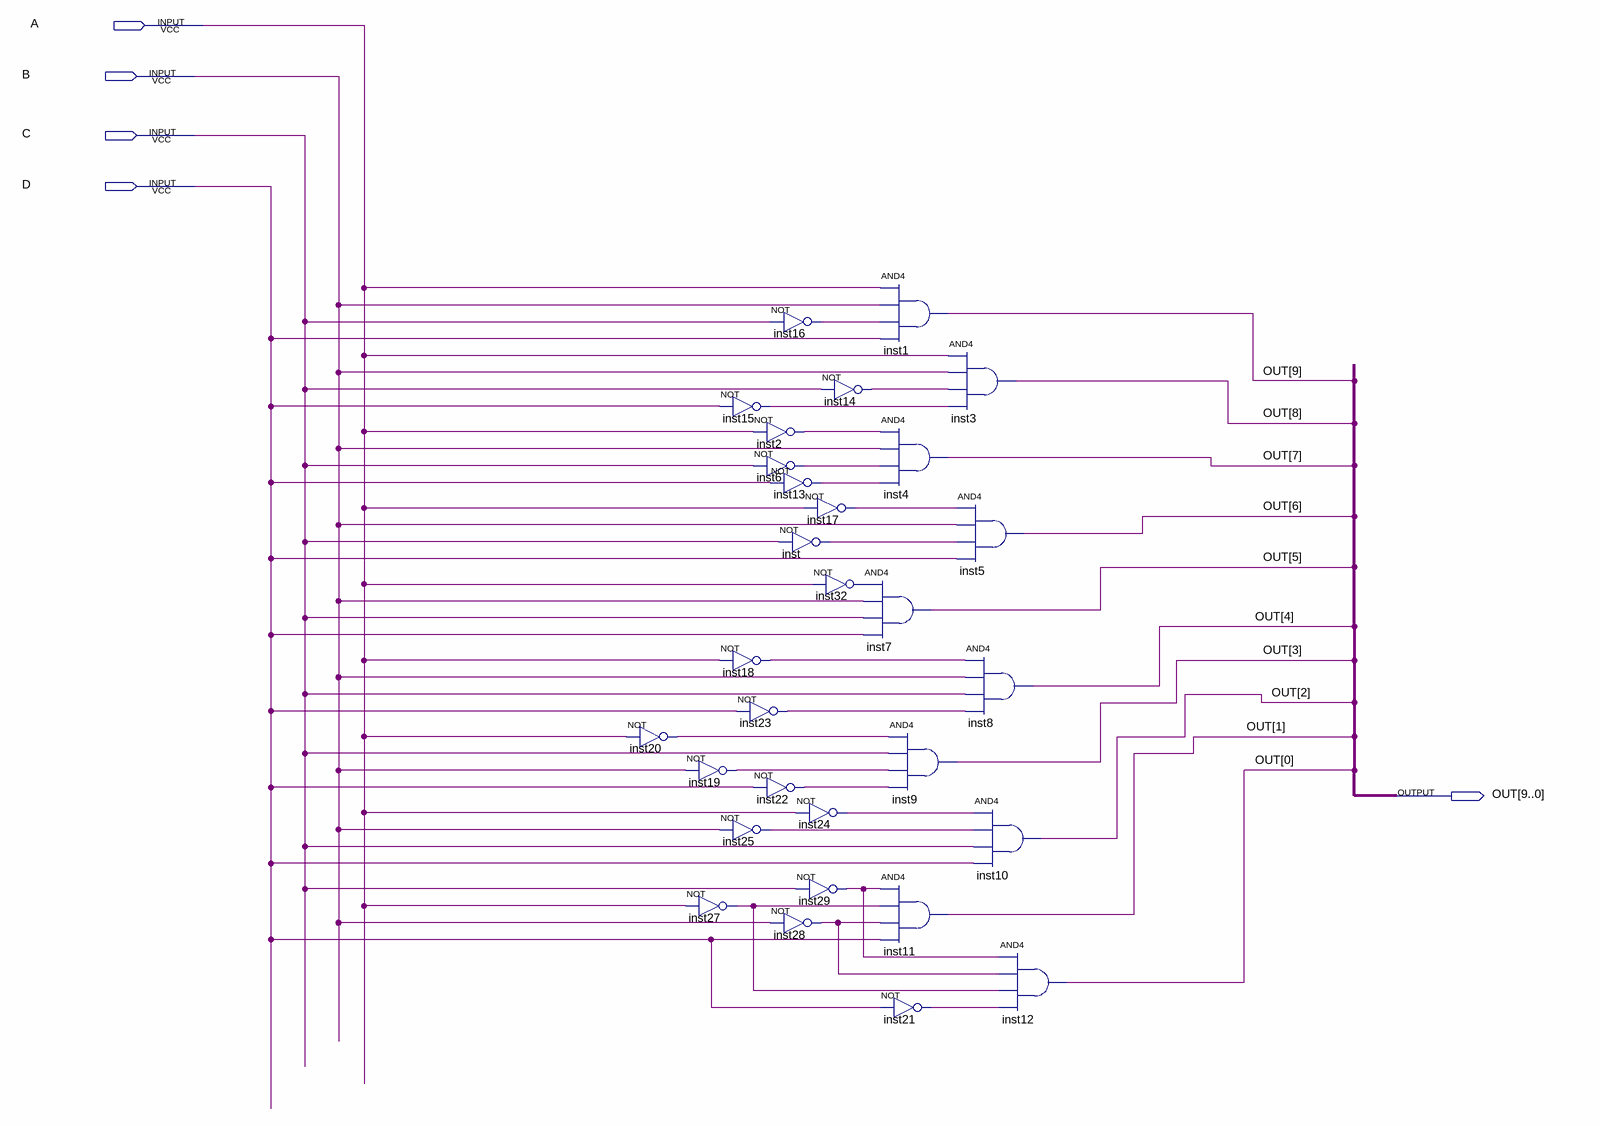
[diagram p0: schematic sheet]
// Quartus schematic Block5.bdf as structural Verilog: 30 symbols, 5 pins
module Block5 (
  input  A,
  input  B,
  input  C,
  input  D,
  output [9:0] OUT
);

  wire inst2_out, inst6_out, inst13_out, inst14_out, inst15_out, inst16_out, inst17_out, inst18_out,
       inst19_out, inst20_out, inst21_out, inst22_out, inst23_out, inst24_out, inst25_out, inst27_out,
       inst28_out, inst29_out, inst32_out, inst_out;

  not inst20 (inst20_out, A);
  not inst19 (inst19_out, B);
  not inst27 (inst27_out, A);
  not inst15 (inst15_out, D);
  not inst2 (inst2_out, A);
  not inst6 (inst6_out, C);
  not inst18 (inst18_out, A);
  not inst23 (inst23_out, D);
  not inst22 (inst22_out, D);
  not inst25 (inst25_out, B);
  not inst16 (inst16_out, C);
  not inst14 (inst14_out, C);
  not inst13 (inst13_out, D);
  not inst17 (inst17_out, A);
  not inst (inst_out, C);
  not inst32 (inst32_out, A);
  not inst24 (inst24_out, A);
  not inst29 (inst29_out, C);
  not inst28 (inst28_out, B);
  and inst1 (OUT[9], A, B, inst16_out, D);
  and inst4 (OUT[7], inst2_out, B, inst6_out, inst13_out);
  and inst7 (OUT[5], inst32_out, B, C, D);
  and inst9 (OUT[3], inst20_out, C, inst19_out, inst22_out);
  and inst11 (OUT[1], inst29_out, inst27_out, inst28_out, D);
  not inst21 (inst21_out, D);
  and inst3 (OUT[8], A, B, inst14_out, inst15_out);
  and inst5 (OUT[6], inst17_out, B, inst_out, D);
  and inst8 (OUT[4], inst18_out, B, C, inst23_out);
  and inst10 (OUT[2], inst24_out, inst25_out, C, D);
  and inst12 (OUT[0], inst29_out, inst28_out, inst27_out, inst21_out);
endmodule
